# EAGLE design xbee-door-alert (EAGLE 8.3.2)
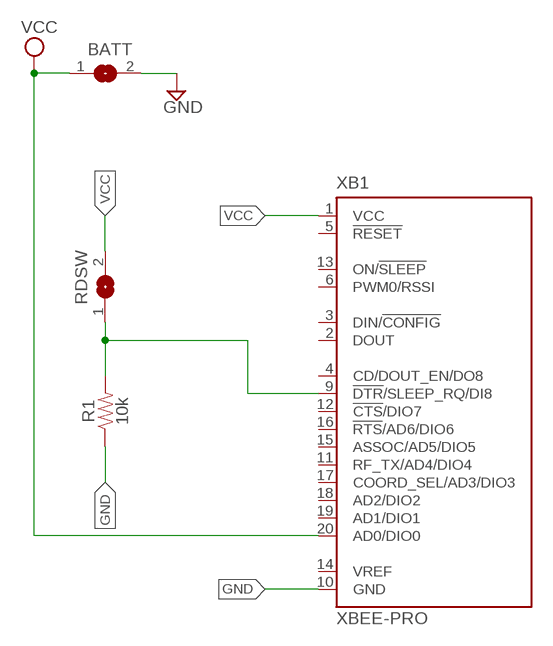
[diagram p0: schematic, sheet 1]

## Parts
BATT  SJW  [SJW]
R1  10k  10KOHM-HORIZ-1/4W-5%  [AXIAL-0.3]
RDSW  SJW  [SJW]
XB1  XBEE-PRO  [XBEE-PRO]

## Nets
GND: BATT.2 R1.P$1 XB1.10(GND)
SLEEP: R1.P$2 RDSW.1 XB1.9(!DTR!/SLEEP_RQ/DI8)
VCC: BATT.1 RDSW.2 XB1.1(VCC) XB1.20(AD0/DIO0)
Unconnected: XB1.2(DOUT) XB1.3(DIN/!CONFIG) XB1.4(CD/DOUT_EN/DO8) XB1.5(!RESET) XB1.6(PWM0/RSSI) XB1.11(RF_TX/AD4/DIO4) XB1.12(!CTS!/DIO7) XB1.13(ON/!SLEEP) XB1.14(VREF) XB1.15(ASSOC/AD5/DIO5) XB1.16(!RTS!/AD6/DIO6) XB1.17(COORD_SEL/AD3/DIO3) XB1.18(AD2/DIO2) XB1.19(AD1/DIO1)

## Library data of the parts
BATT RDSW = jumper:SJ: SMD solder JUMPER
R1 = SparkFun-Resistors:10KOHM: 10kΩ resistor A resistor is a passive two-terminal electrical component that implements electrical resistance as a circuit element. Resistors act to reduce current flow, and, at the same time, act to lower voltage levels within circuits. - Wikipedia; PROD_ID: RES-09435
XB1 = maxstream:XBEE: XBee (TM) /XBee-PRO(TM) OEM RF Modules Source: MaxStream, Inc. xbee_productmanual.pdf; MPN: XBP24-AWI-001; OC_FARNELL: 1337916; OC_NEWARK: 42M2667

## Net classes
0 default: width 0.203 mm

## Board
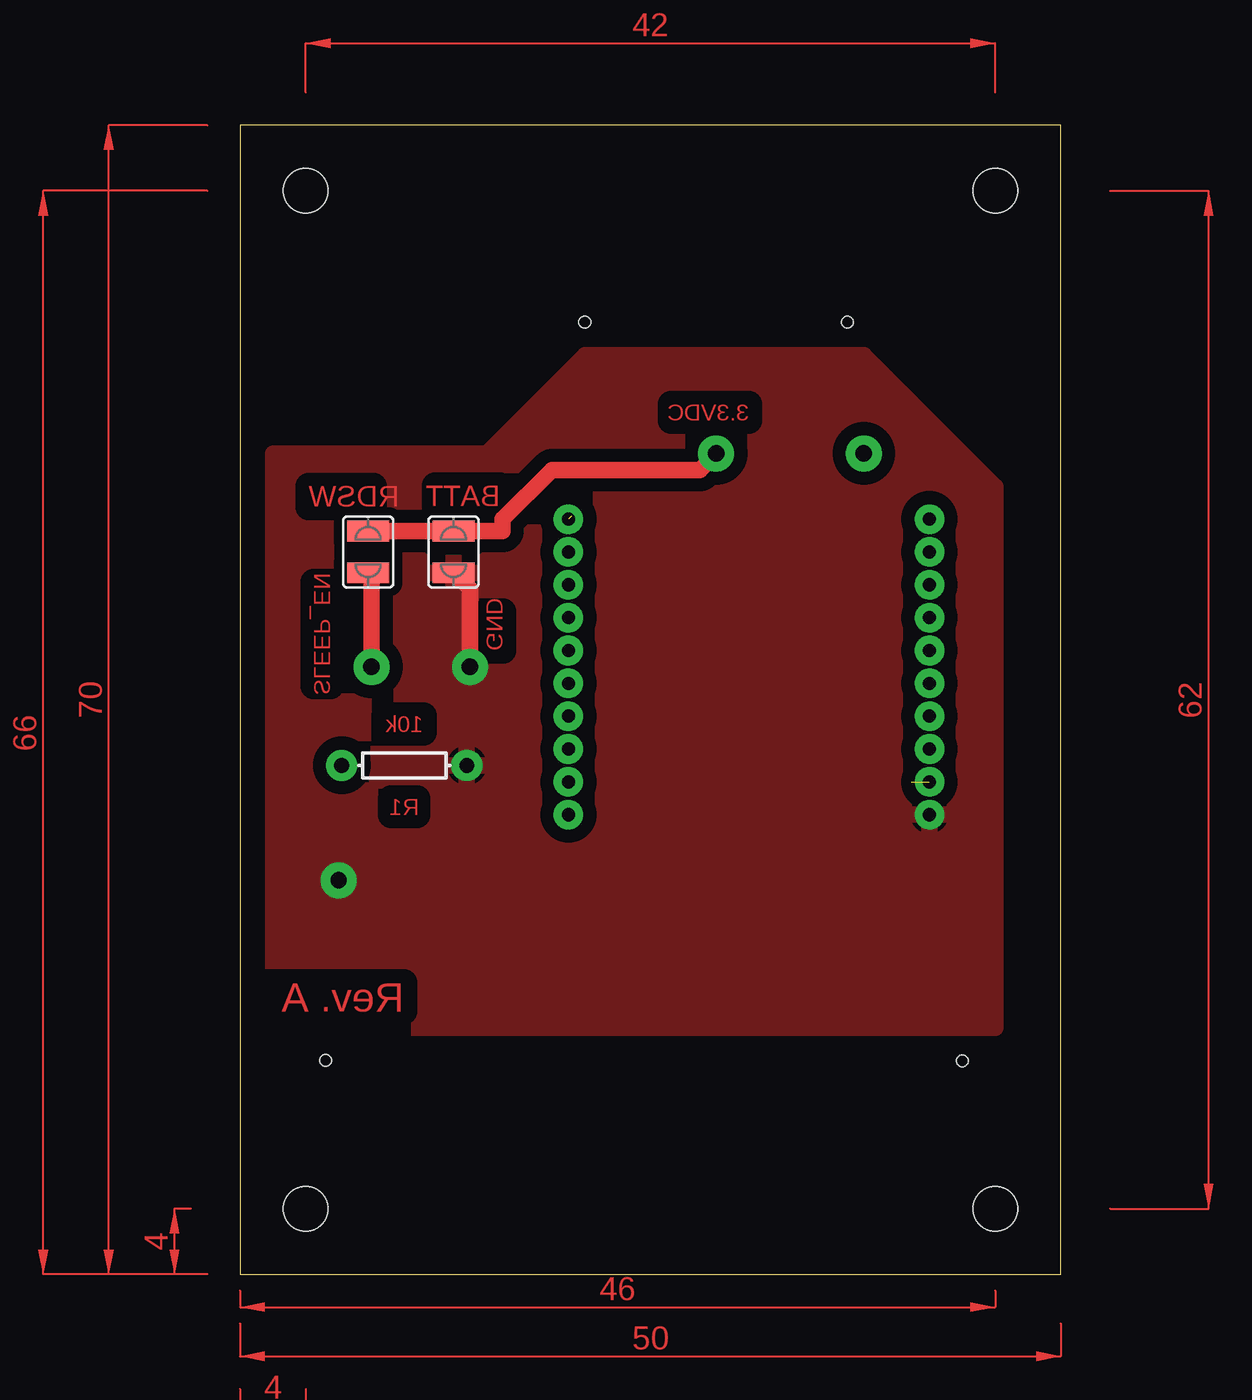
[diagram p1: board, top side]
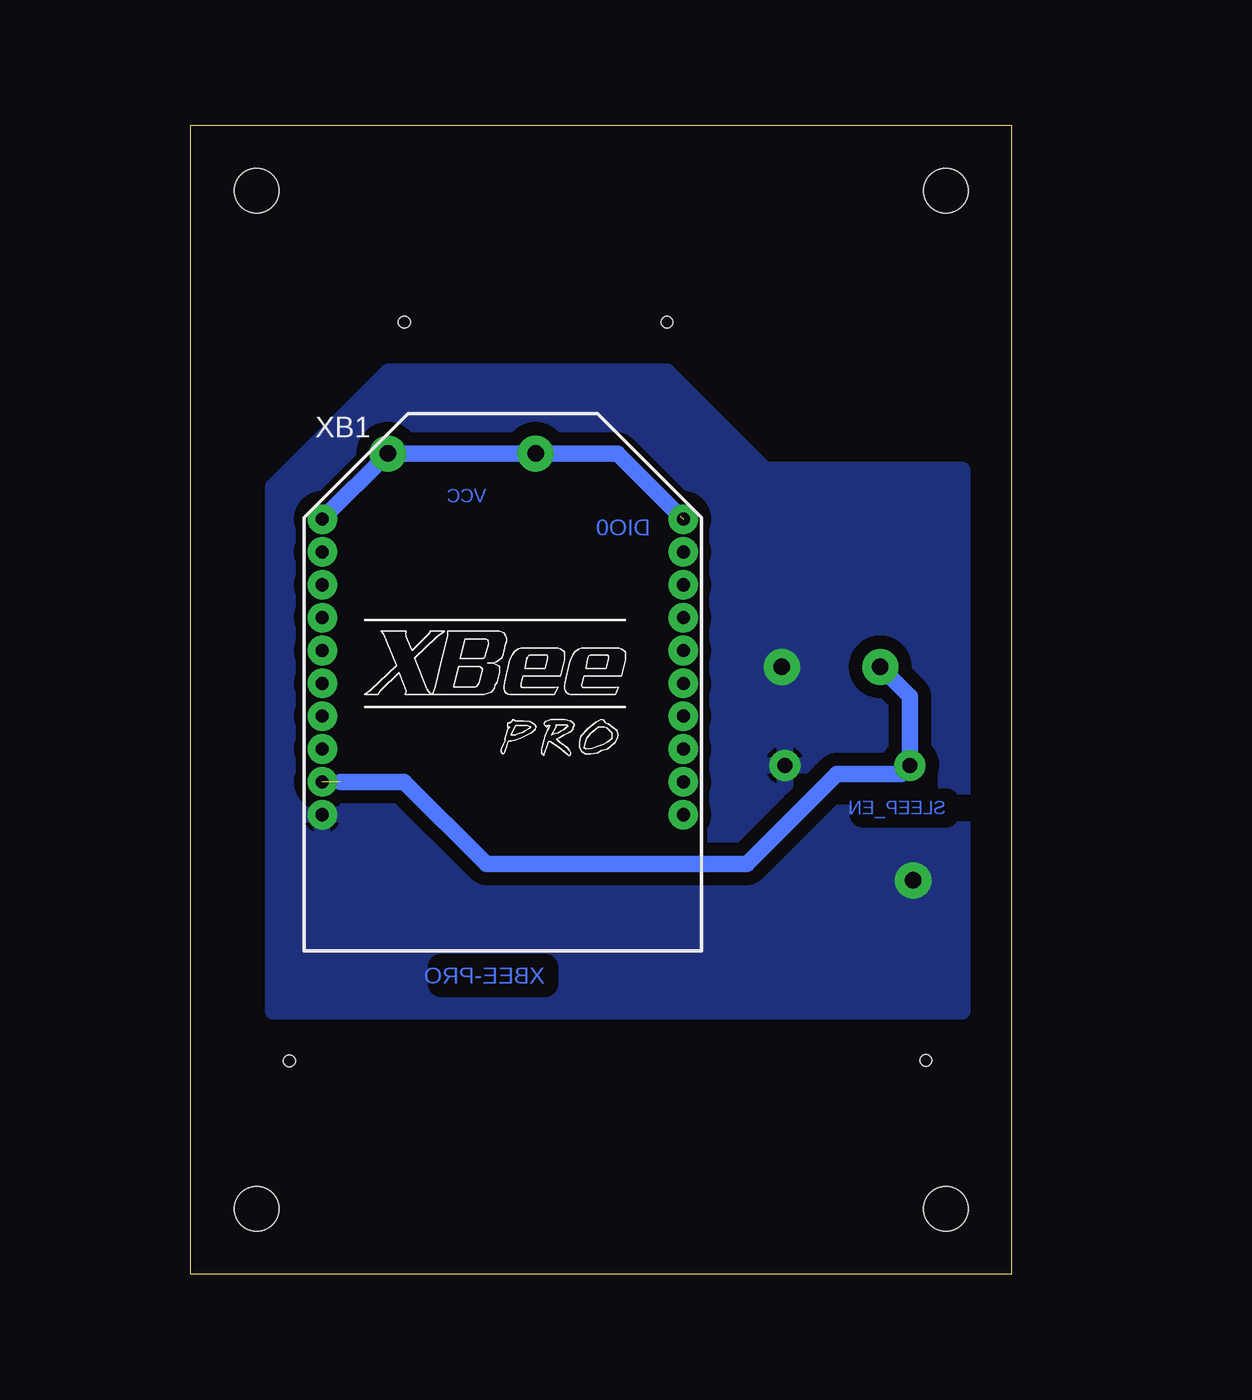
[diagram p2: board, bottom side, seen from below]

Size 50 x 70 mm. Coordinates in mm from the lower left corner, seen from the top.
Outline: 0,0 50,0 50,70 0,70 0,0
Copper layers (1*16): Top 0.035mm / dielectric 1.5mm / Bottom 0.035mm
Design rules "home-pcb *": minimum track width 0.8mm, minimum drill 0.8mm, track to track 0.8mm, track to pad 0.8mm, pad to pad 0.45mm, via to via 0.8mm, smd to smd 8mil, copper to edge 40mil, drill to drill 6mil, minimum pad ring 0.5mm, minimum via ring 0.6mm, stop-mask expansion 4mil, vias tented up to drill 0mil, thermal gap 10mil
Holes 2.7 mm at 4,4 4,66 46,66 46,4
Holes 0.7 mm at 5.21,13.03 44,13 21,58 37,58

### Footprints (pad centres in the part's own frame; a part is rotated, then mirrored left to right if it is on the bottom)
SJW = smd 1.27 x 2.54: 1 -1.27,0; 2 1.27,0
AXIAL-0.3 = drill 0.9 pad 1.88: P$1 -3.81,0; P$2 3.81,0
XBEE-PRO = drill 0.8 pad 1.27: 1 -11,9; 2 -11,7; 3 -11,5; 4 -11,3; 5 -11,1; 6 -11,-1; 7 -11,-3; 8 -11,-5; 9 -11,-7; 10 -11,-9; 11 11,-9; 12 11,-7; 13 11,-5; 14 11,-3; 15 11,-1; 16 11,1; 17 11,3; 18 11,5; 19 11,7; 20 11,9

### Placement (x,y rotation side)
BATT  13,44 270 top
R1  10,31 180 top
RDSW  7.8,44 90 top
XB1  31,37 0 bottom

### Tracks (layer width: path | path; a pad name or v marks a point on that pad's centre or on a via)
GND  (via drill 1)
  Top 1: BATT.2 14,41.73 v14,37
  Bottom 1: v14,37 13.81,36.81
  other vias: 6,24
  pour Bottom: 3,49 15,49 21,55 38,55 45,48 45,16 3,16
  pour Top: 15,50 21,56 38,56 46,48 46,15 3,15 2,16 2,50
SLEEP  (via drill 1)  (1 unrouted)
  Top 1: RDSW.1 8,42.53 v8,37
  Bottom 1: v8,37 6.19,35.19 R1.P$2 | R1.P$2 6.19,30.81 | R1.P$2 6.72,30.47 10.64,30.47 16.11,25 32,25 37,30 40.89,30
VCC  (via drill 1)  (1 unrouted)
  Top 1: RDSW.2 BATT.1 16,45.27 16,46 19,49 28,49 v29,50
  Bottom 1: 20.2,46.2 24,50 v29,50 v38,50 XB1.1
(copper drawn outside any net)
  shapes: Top area x8

### Text on the board
Top: 3.3VDC | SLEEP_EN | GND | Rev. A
Bottom: VCC | DIO0 | SLEEP_EN